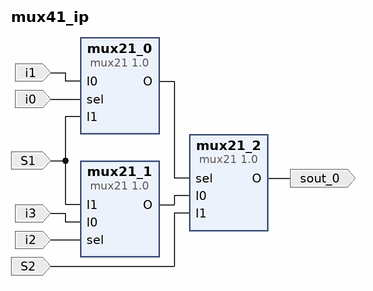
[diagram p0: block diagram of the top level]
# Vivado block design mux41_ip, xc7z020clg484-1, Vivado 2023.2
create_bd_design mux41_ip

create_bd_port -dir I i0
create_bd_port -dir I i1
create_bd_port -dir I S1
create_bd_port -dir I S2
create_bd_port -dir I i3
create_bd_port -dir I i2
create_bd_port -dir O sout_0

create_bd_cell -type ip -vlnv xilinx.com:user:mux21:1.0 mux21_0
create_bd_cell -type ip -vlnv xilinx.com:user:mux21:1.0 mux21_1
create_bd_cell -type ip -vlnv xilinx.com:user:mux21:1.0 mux21_2

# ---- connections ----

connect_bd_net -net I0_0_1 [get_bd_ports i1] [get_bd_pins mux21_0/I0]
connect_bd_net -net I0_0_2 [get_bd_ports i3] [get_bd_pins mux21_1/I0]
connect_bd_net -net I1_0_1 [get_bd_ports S1] [get_bd_pins mux21_0/I1] [get_bd_pins mux21_1/I1]
connect_bd_net -net I1_0_2 [get_bd_ports S2] [get_bd_pins mux21_2/I1]
connect_bd_net [get_bd_pins mux21_0/O] [get_bd_pins mux21_2/sel]
connect_bd_net [get_bd_pins mux21_1/O] [get_bd_pins mux21_2/I0]
connect_bd_net [get_bd_pins mux21_2/O] [get_bd_ports sout_0]
connect_bd_net -net sel_0_1 [get_bd_ports i0] [get_bd_pins mux21_0/sel]
connect_bd_net -net sel_0_2 [get_bd_ports i2] [get_bd_pins mux21_1/sel]

validate_bd_design
save_bd_design
